# Altium schematic sheet Sheet1.SchDoc
size A4
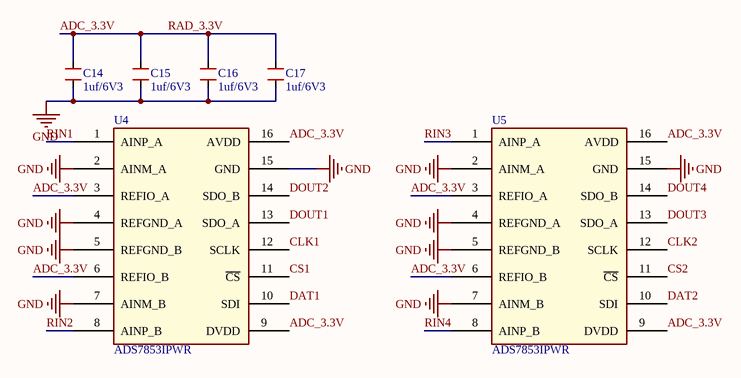
[diagram p0: Sheet1.SchDoc]

## Parts
C14  1uf/6V3  [CAP0603]
C15  1uf/6V3  [CAP0603]
C16  1uf/6V3  [CAP0603]
C17  1uf/6V3  [CAP0603]
U4  ADS7853IPWR  [TSSOP16-0.65-5X4.4MM]
U5  ADS7853IPWR  [TSSOP16-0.65-5X4.4MM]

## Nets
GND: C14.2 C15.2 C16.2 C17.2 U4.2(AINM_A) U4.4(REFGND_A) U4.5(REFGND_B) U4.7(AINM_B) U4.15(GND) U5.2(AINM_A) U5.4(REFGND_A) U5.5(REFGND_B) U5.7(AINM_B) U5.15(GND)
ADC_3.3V: C14.1 C15.1 C16.1 C17.1 U4.3(REFIO_A) U4.6(REFIO_B) U4.9(DVDD) U4.16(AVDD) U5.3(REFIO_A) U5.6(REFIO_B) U5.9(DVDD) U5.16(AVDD)  [also labelled RAD_3.3V]
CLK1: U4.12(SCLK)
CLK2: U5.12(SCLK)
CS1: U4.11(~{CS})
CS2: U5.11(~{CS})
DAT1: U4.10(SDI)
DAT2: U5.10(SDI)
DOUT1: U4.13(SDO_A)
DOUT2: U4.14(SDO_B)
DOUT3: U5.13(SDO_A)
DOUT4: U5.14(SDO_B)
RIN1: U4.1(AINP_A)
RIN2: U4.8(AINP_B)
RIN3: U5.1(AINP_A)
RIN4: U5.8(AINP_B)

## Library data of the parts
C14-C17 = CAPACITOR_1UF: Generic Capacitor; Value: 4.7uF; DPN: *; Manufacturer: *